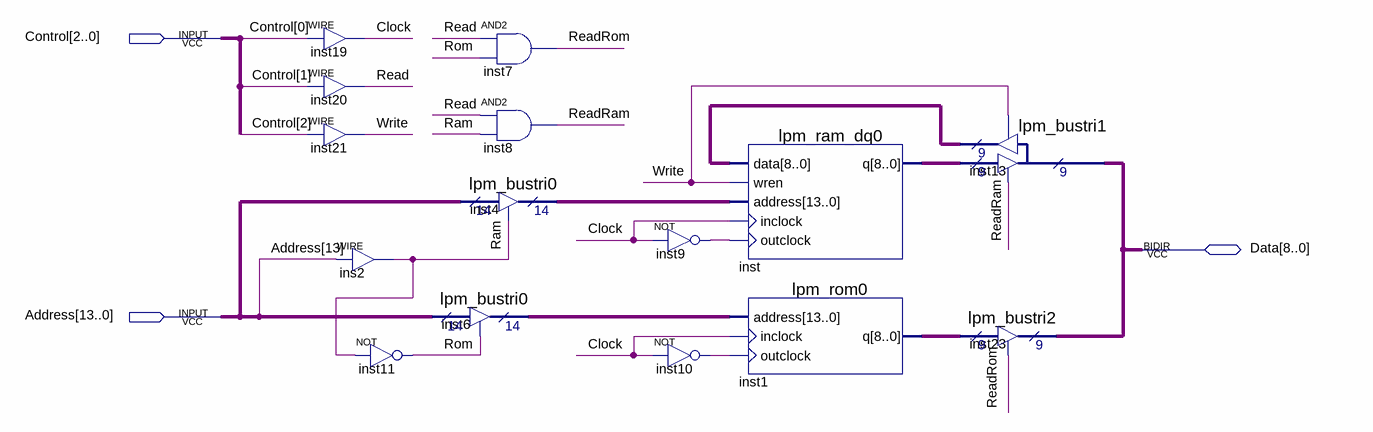
[diagram p0: schematic sheet]
// Quartus schematic MemoryBlock.bdf as structural Verilog: 15 symbols, 3 pins
module MemoryBlock (
  input  [2:0] Control,
  input  [13:0] Address,
  inout  [8:0] Data
);

  wire Clock, inst9_out, inst10_out, Ram, Read, ReadRam, ReadRom, Rom, Write;
  wire [8:0] inst1_q, inst13_result, inst_q;
  wire [13:0] inst4_tridata, inst6_tridata;

  assign Clock = Control[0];  // WIRE inst19
  assign Read = Control[1];  // WIRE inst20
  assign Write = Control[2];  // WIRE inst21
  assign Ram = Address[13];  // WIRE ins2
  not inst11 (Rom, Ram);
  lpm_bustri0 inst4 (.enabledt(Ram), .data(Address), .tridata(inst4_tridata));
  lpm_bustri0 inst6 (.enabledt(Rom), .data(Address), .tridata(inst6_tridata));
  and inst7 (ReadRom, Read, Rom);
  and inst8 (ReadRam, Read, Ram);
  not inst9 (inst9_out, Clock);
  not inst10 (inst10_out, Clock);
  lpm_ram_dq0 inst (
    .data(inst13_result), .wren(Write), .address(inst4_tridata), .inclock(Clock), .outclock(inst9_out),
    .q(inst_q));
  lpm_rom0 inst1 (.address(inst6_tridata), .inclock(Clock), .outclock(inst10_out), .q(inst1_q));
  lpm_bustri1 inst13 (.enabledt(ReadRam), .data(inst_q), .enabletr(Write), .result(inst13_result), .tridata(Data));
  lpm_bustri2 inst23 (.enabledt(ReadRom), .data(inst1_q), .tridata(Data));
endmodule
